# Altium schematic sheet I2C.SchDoc
size A; SheetNumber: 7; SheetTotal: 9
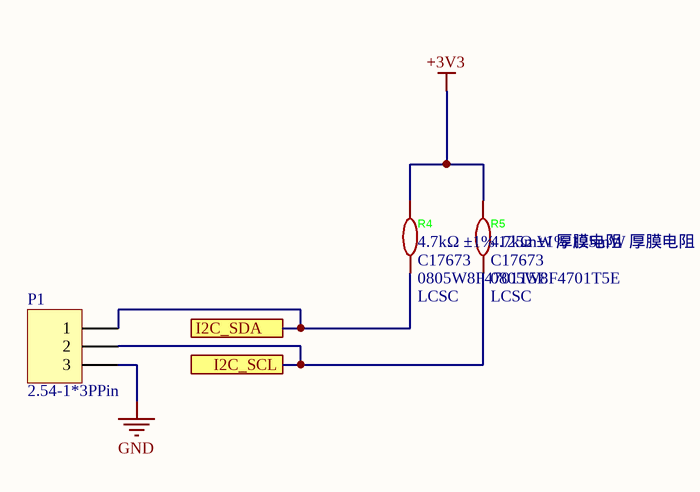
[diagram p0: I2C.SchDoc]

## Parts
P1  2.54-1*3PPin  [HDR1X3]
R4  LCSC Part Name: 4.7kΩ ±1% 125mW 厚膜电阻  Supplier Part: C17673  Supplier: LCSC  [R0805]  (hidden comment: 4.7kΩ)
R5  LCSC Part Name: 4.7kΩ ±1% 125mW 厚膜电阻  Supplier Part: C17673  Supplier: LCSC  [R0805]  (hidden comment: 4.7kΩ)

## Ports
I2C_SCL, I2C_SDA

## Nets
+3V3: R4.2 R5.2
GND: P1.3
I2C_SCL: P1.2 R5.1 ; port I2C_SCL
I2C_SDA: P1.1 R4.1 ; port I2C_SDA

## Library data of the parts
P1 = Header 3: -40℃~+105℃ 1 1x3P 2.54mm 2.5mm 3A 3P 3mm 6mm Black Brass Gold Pin Header Through Hole Plugin,P=2.54mm Pin Headers ROHS; LatestRevisionDate: 17-Jul-2002; LatestRevisionNote: Re-released for DXP Platform.; Publisher: Altium Limited
R4 R5 = 0805W8F4701T5E: Manufacturer: UNI-ROYAL(厚声); Add into BOM: yes; Tolerance: ±1%; Temperature Coefficient: ±100ppm/℃; Symbol: 0805W8F4701T5E; Device: 0805W8F4701T5E; Supplier Footprint: 0805; JLCPCB Part Class: Basic Part; Datasheet: https://atta.szlcsc.com/upload/public/pdf/source/20200306/C422600_1E6D84923E4A46A82E41ADD87F860B5C.pdf; Convert to PCB: yes; Type: Thick Film Resistors; Value: 4.7kΩ; Operating Temperature Range: -55℃~+155℃; Manufacturer Part: 0805W8F4701T5E